# EasyEDA schematic d_00_e_00.json
TITLE: Sheet_1; REV: 1.0; Date: 2021-02-06; Sheet: 1/1; Company: Your Company
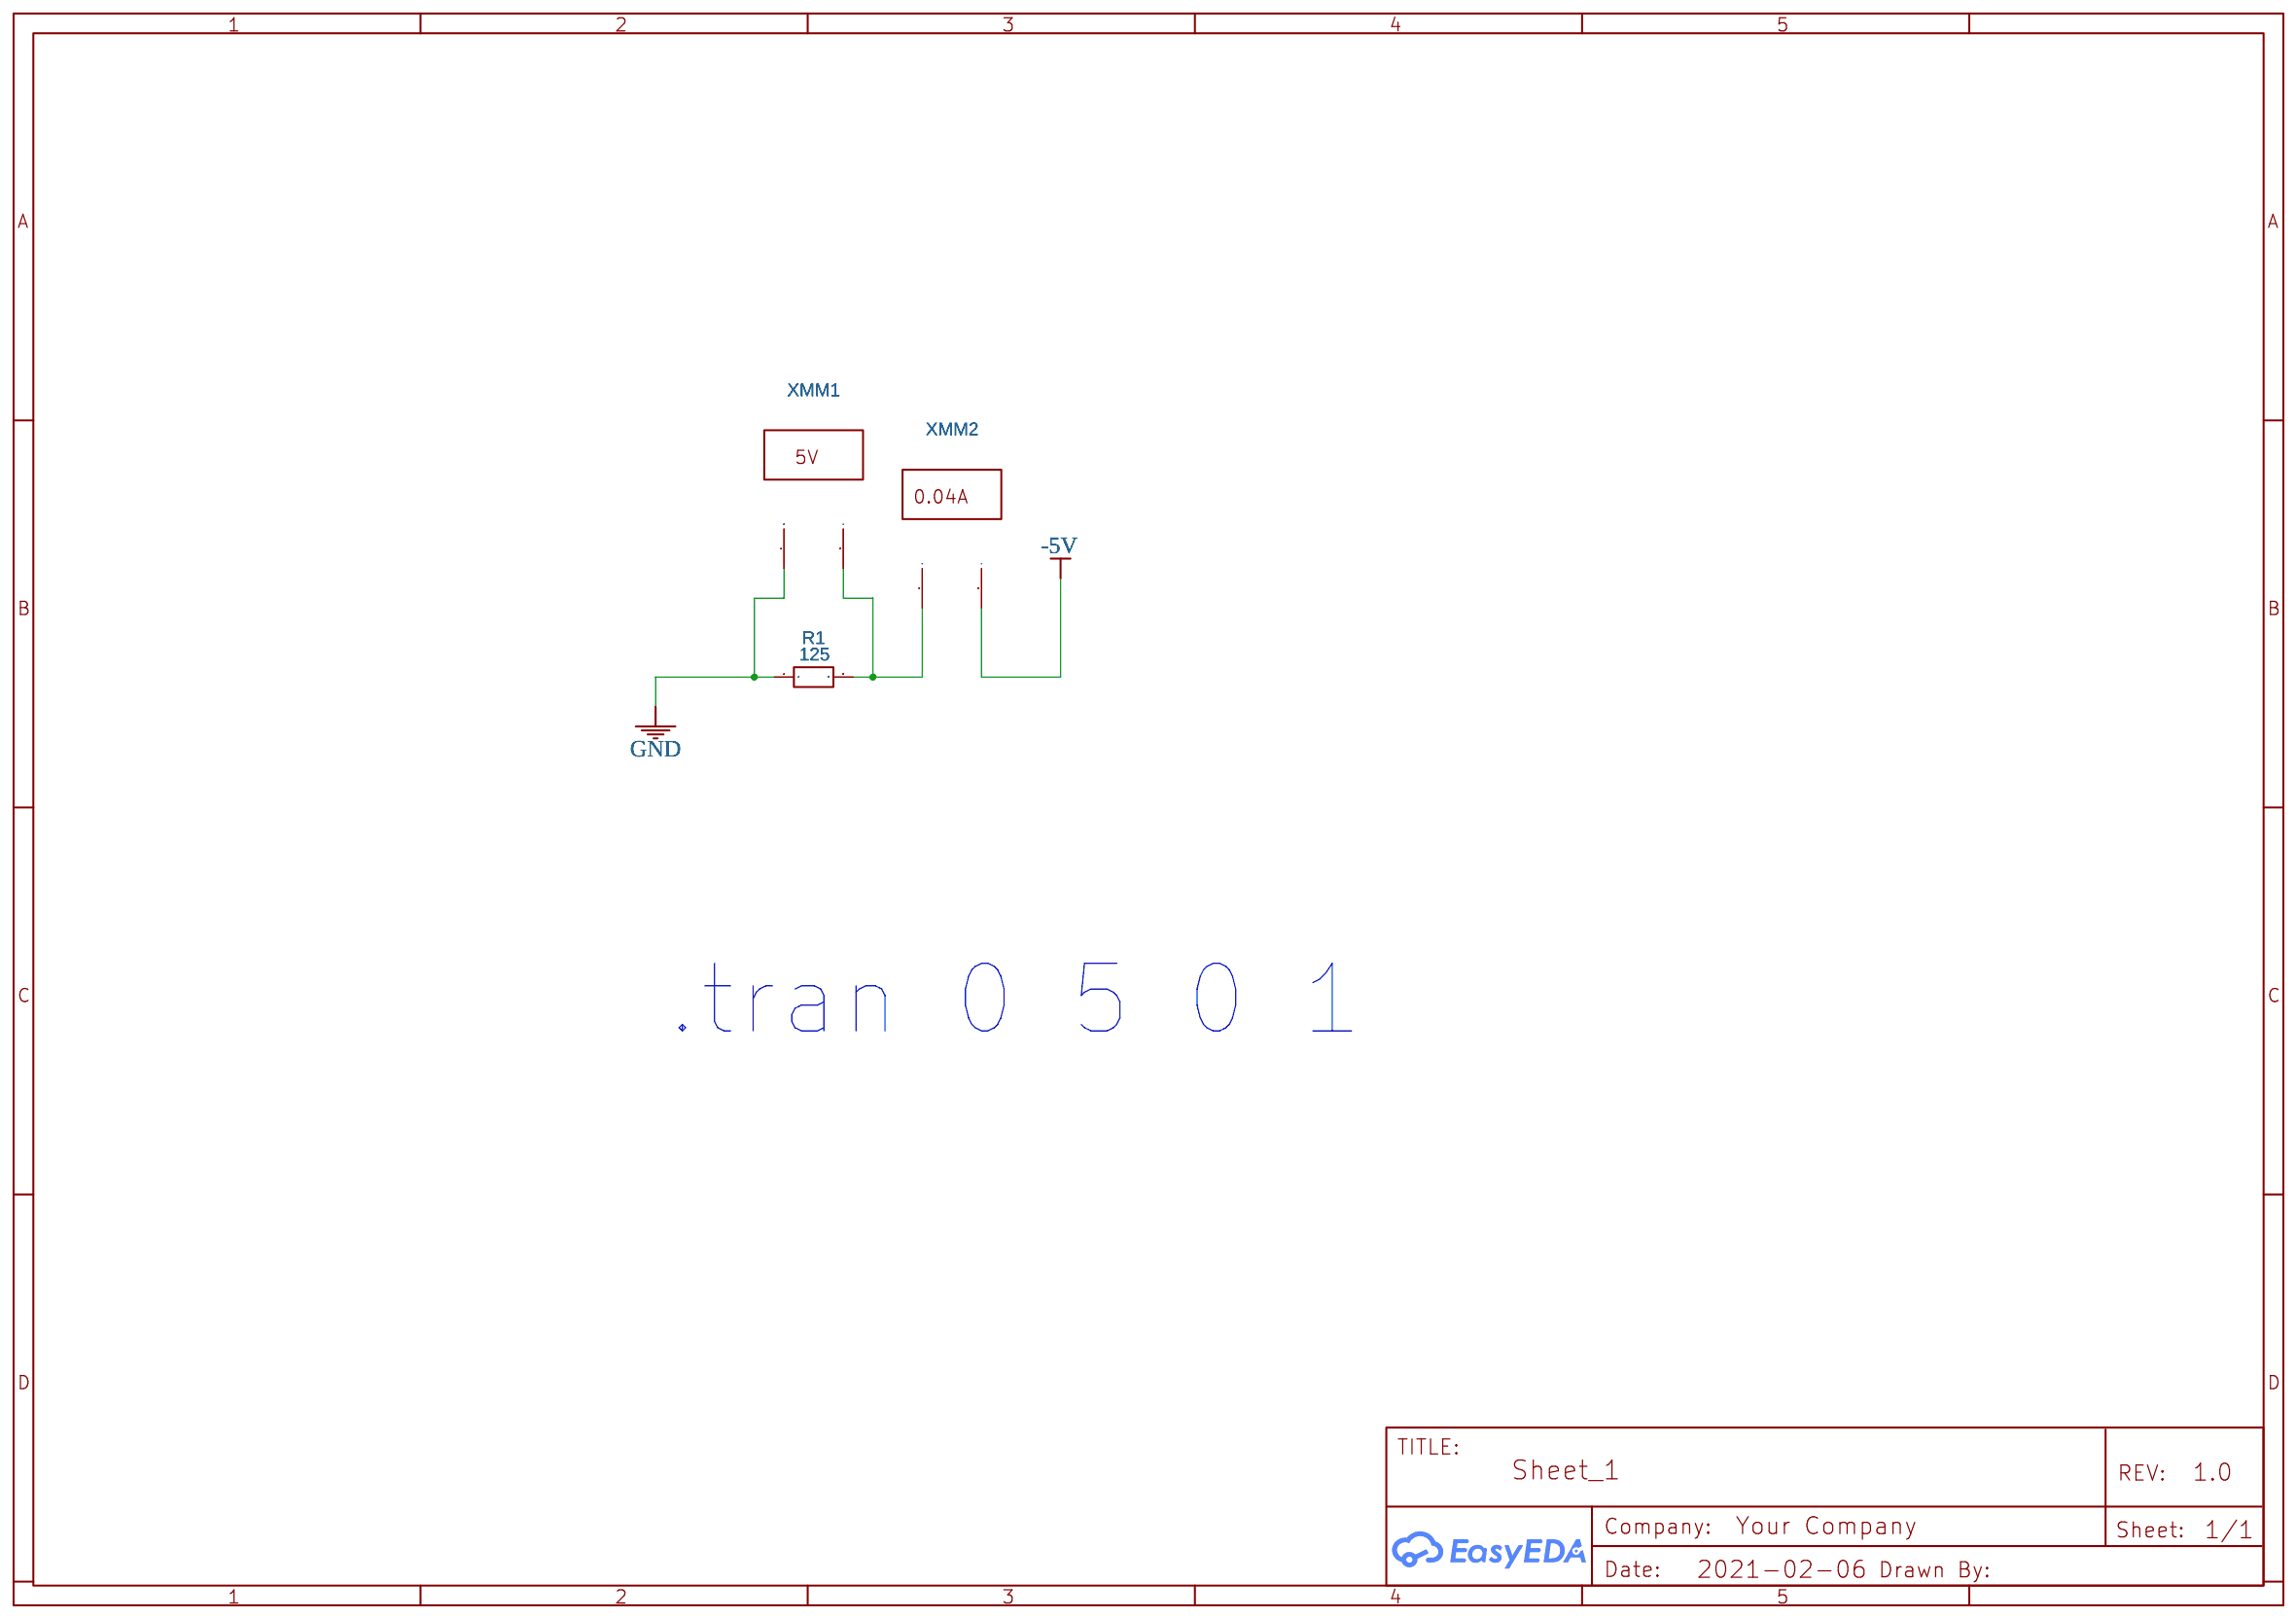
[diagram p0: schematic sheet]

## Parts
R1  125  [R0603]
XMM1  Multimeter
XMM2  Multimeter

## Library data of the parts
R1 = R_0603_EU: Contributor: LCEDA_Lib
XMM1 = MULTIMETER: Supplier: LCSC; Multimeter Type: Voltmeter; Power Type: AC; Voltmeter resistance: 10μ; Ammeter resistance: 1G; NameDisplay: 0; Contributor: EasyEDA; sim: true
XMM2 = MULTIMETER: Supplier: LCSC; Multimeter Type: Amper; Power Type: AC; Voltmeter resistance: 10μ; Ammeter resistance: 1G; NameDisplay: 0; Contributor: EasyEDA; sim: true

## Nets
-5V: XMM2.2(I)
GND: R1.1 XMM1.1(+)
Net-(R1-2): R1.2 XMM1.2(I) XMM2.1(+)

## Notes on the sheet
- .tran 0 5 0 1
